# EasyEDA schematic SCH_Syntheseproject_2022-10-25.json

## Sheets
1 Elektrische schema: TITLE: Elektrisch schema; REV: 1.0; Date: 2022-10-17; Sheet: 1/1; Drawn By: remusfratus; Company: HoGent
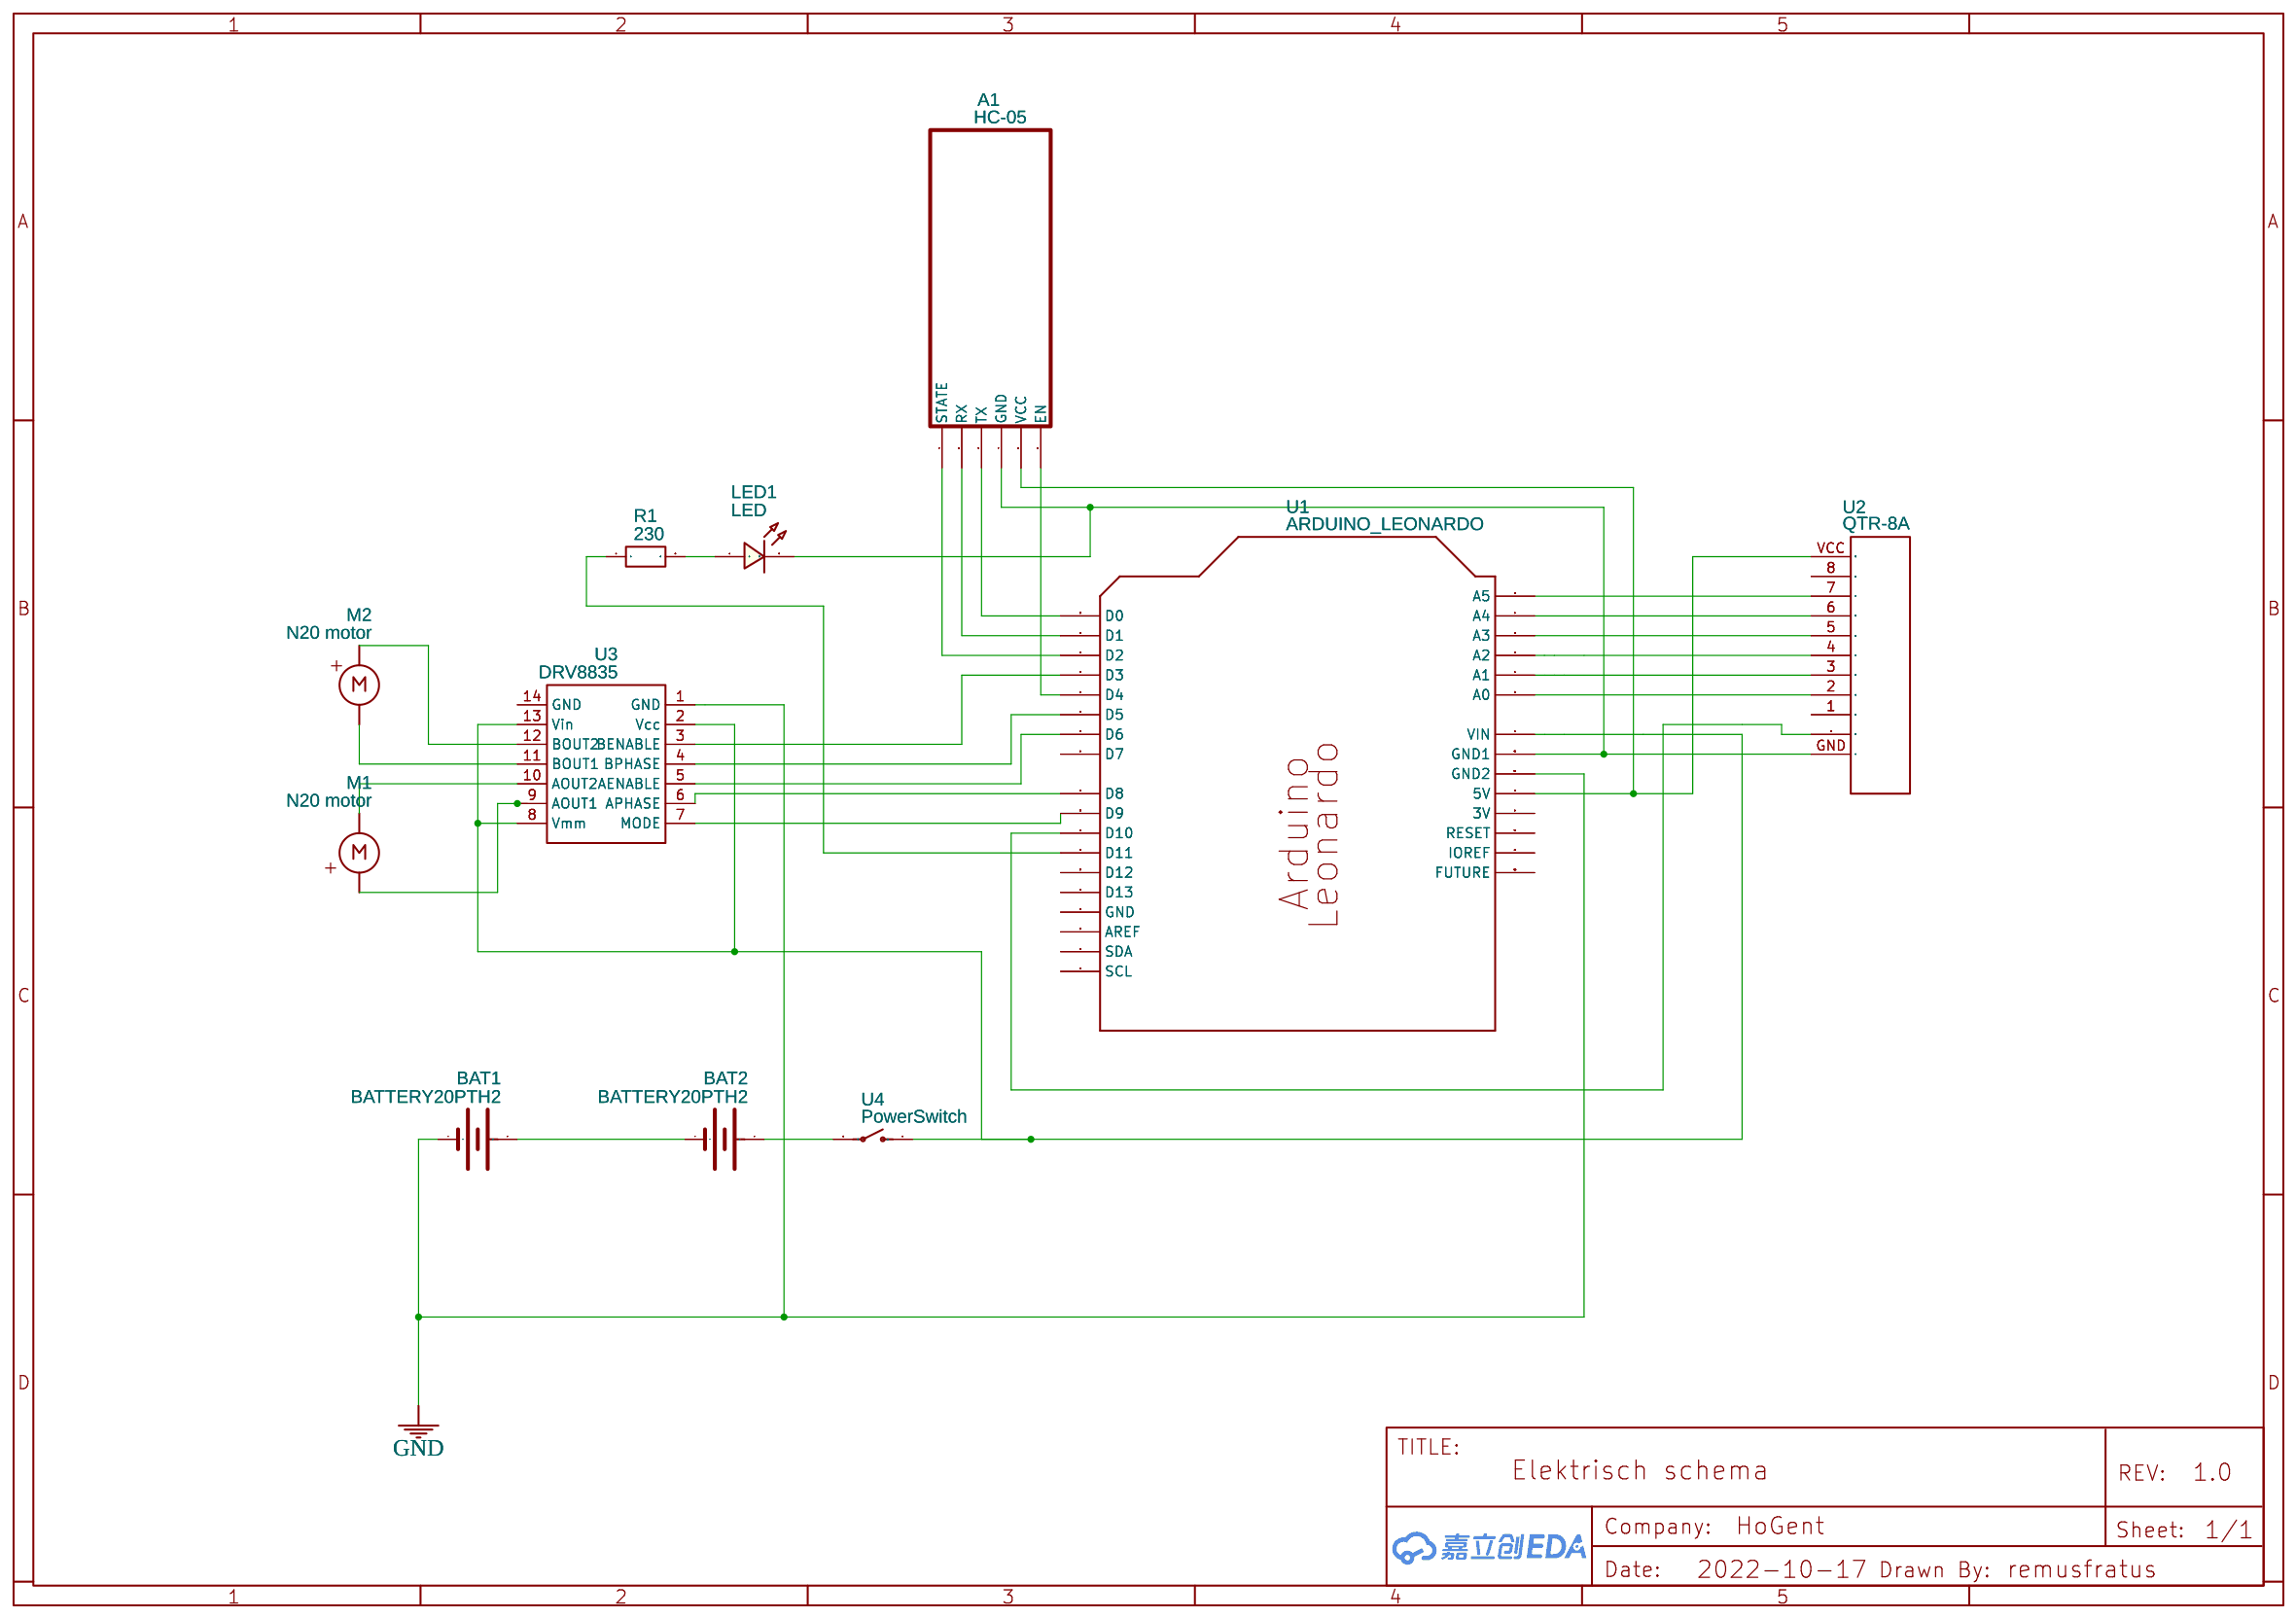
[diagram p0: Elektrische schema]
2 POC H-brug: TITLE: Sheet_3; Date: 2022-10-25; Company: Your Company
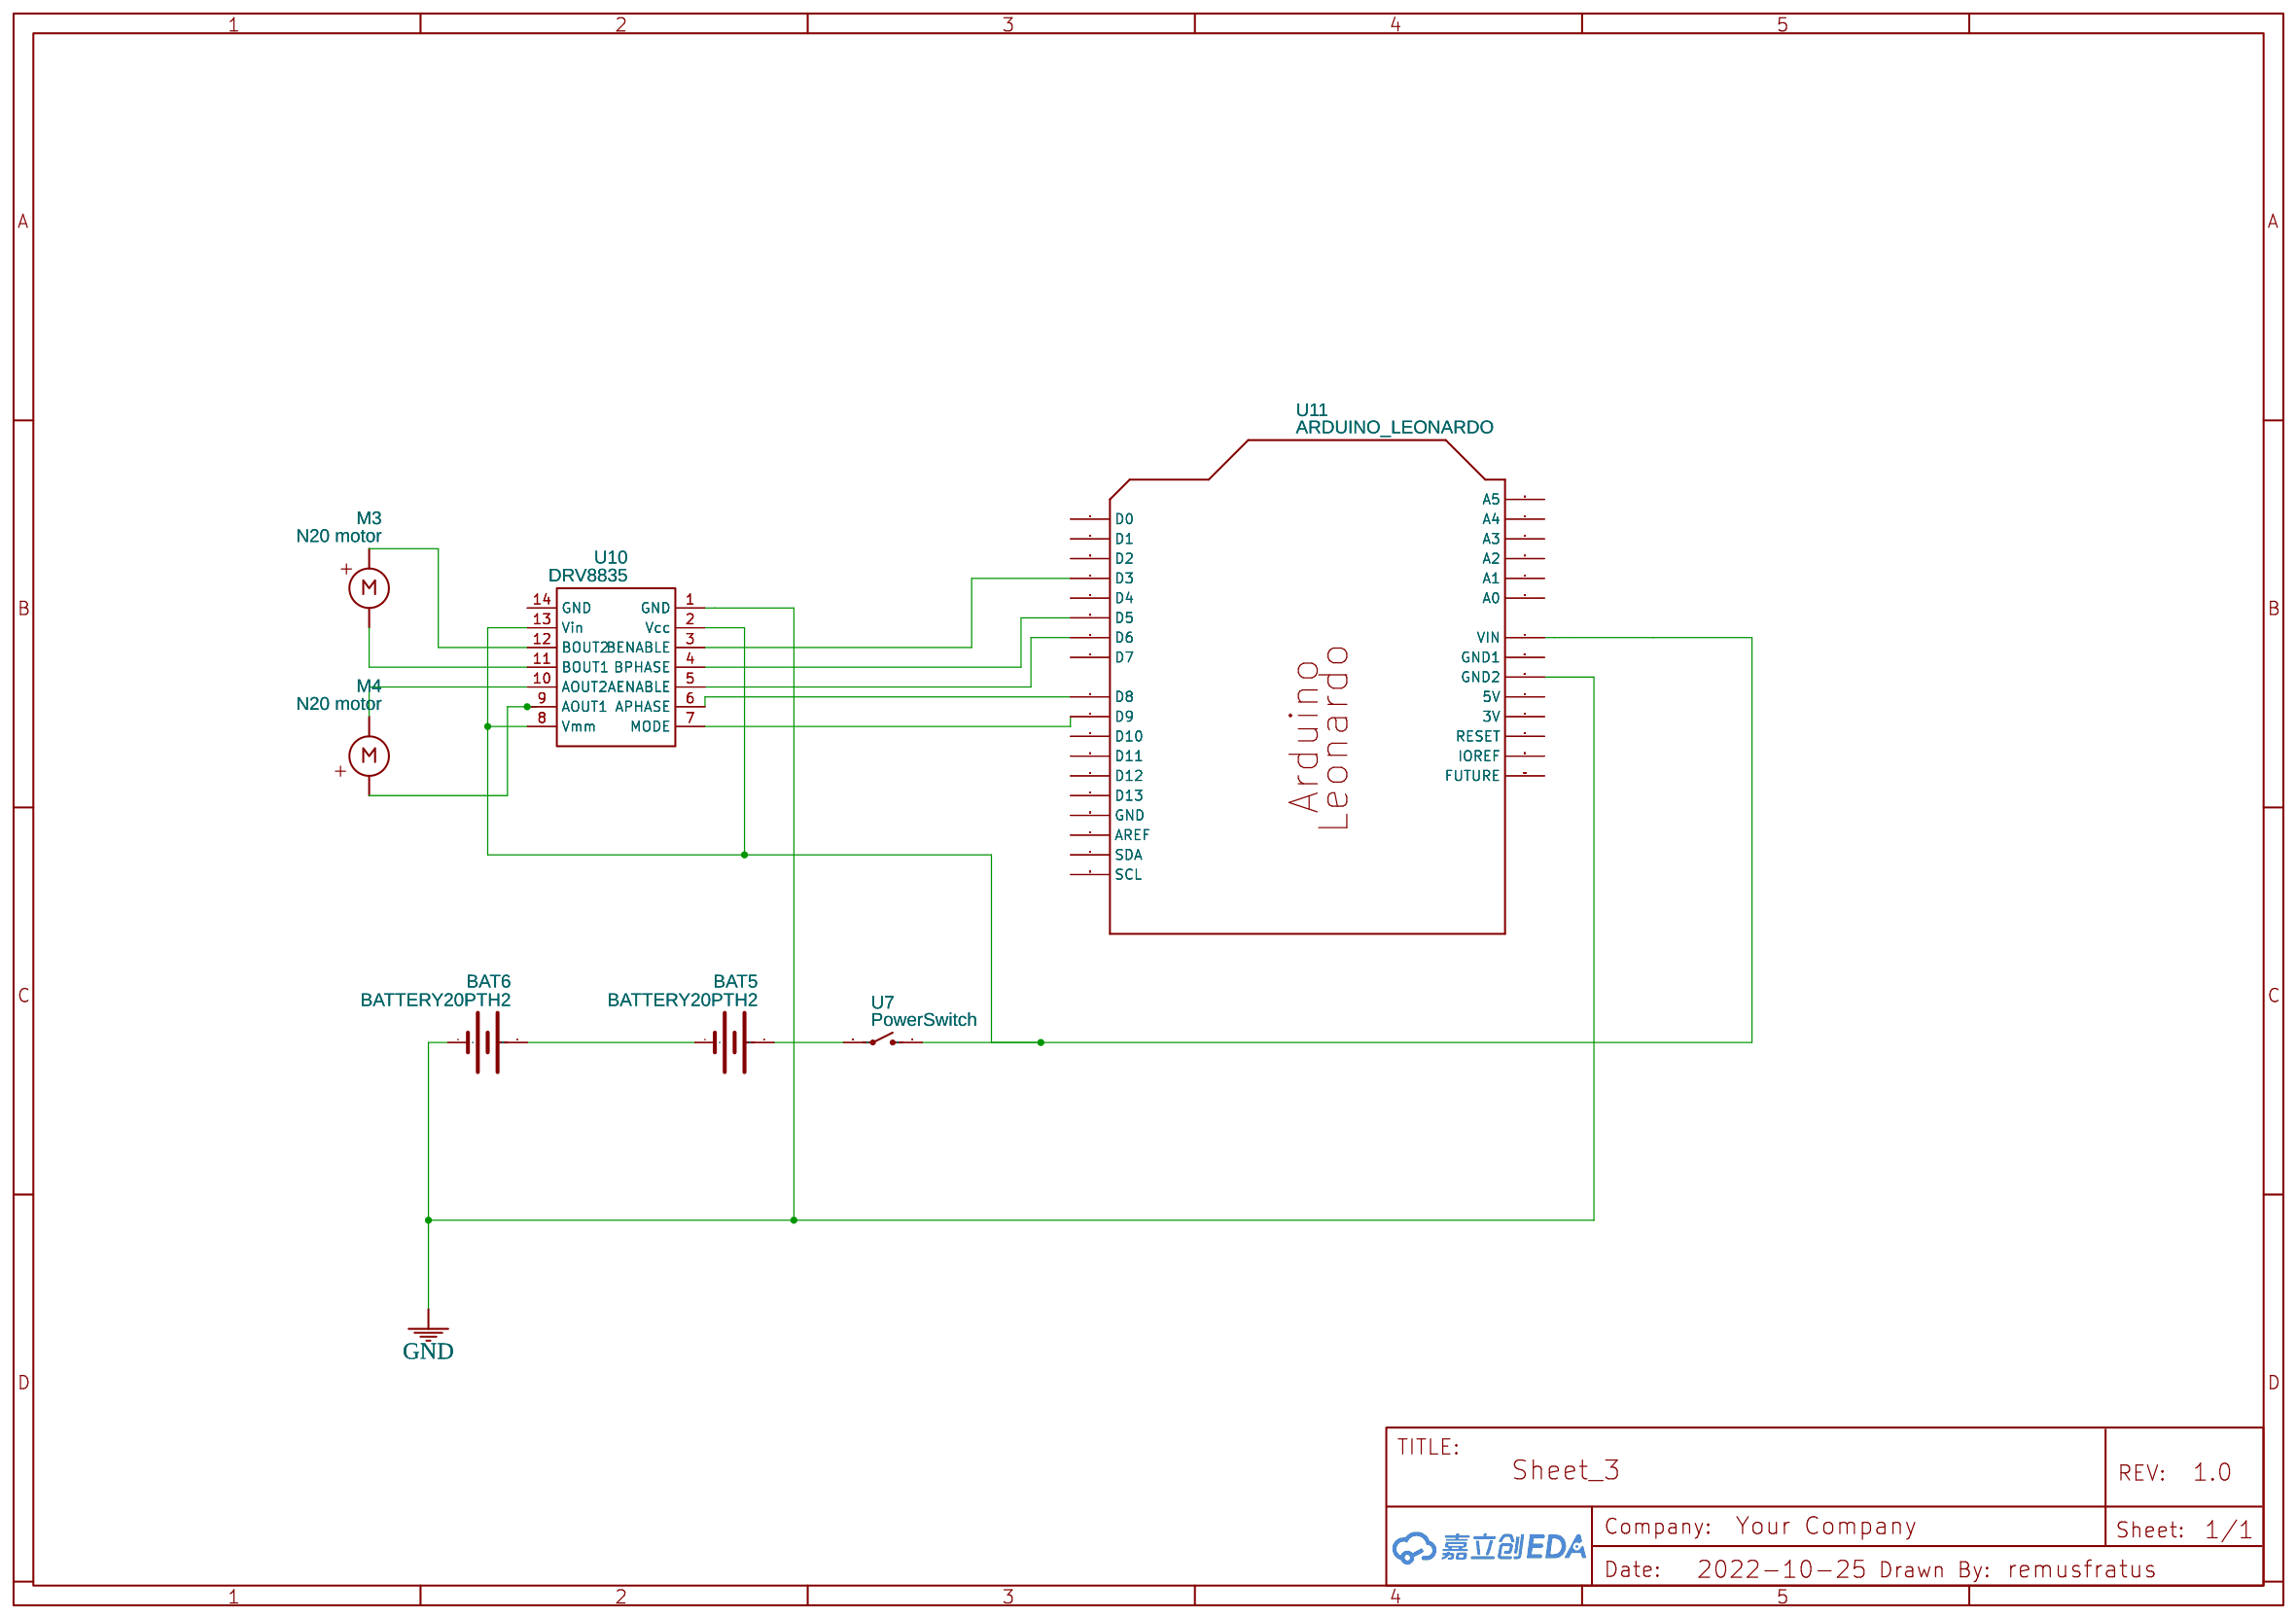
[diagram p1: POC H-brug]
3 POC sensor: TITLE: Sheet_2; Date: 2022-10-25; Company: Your Company
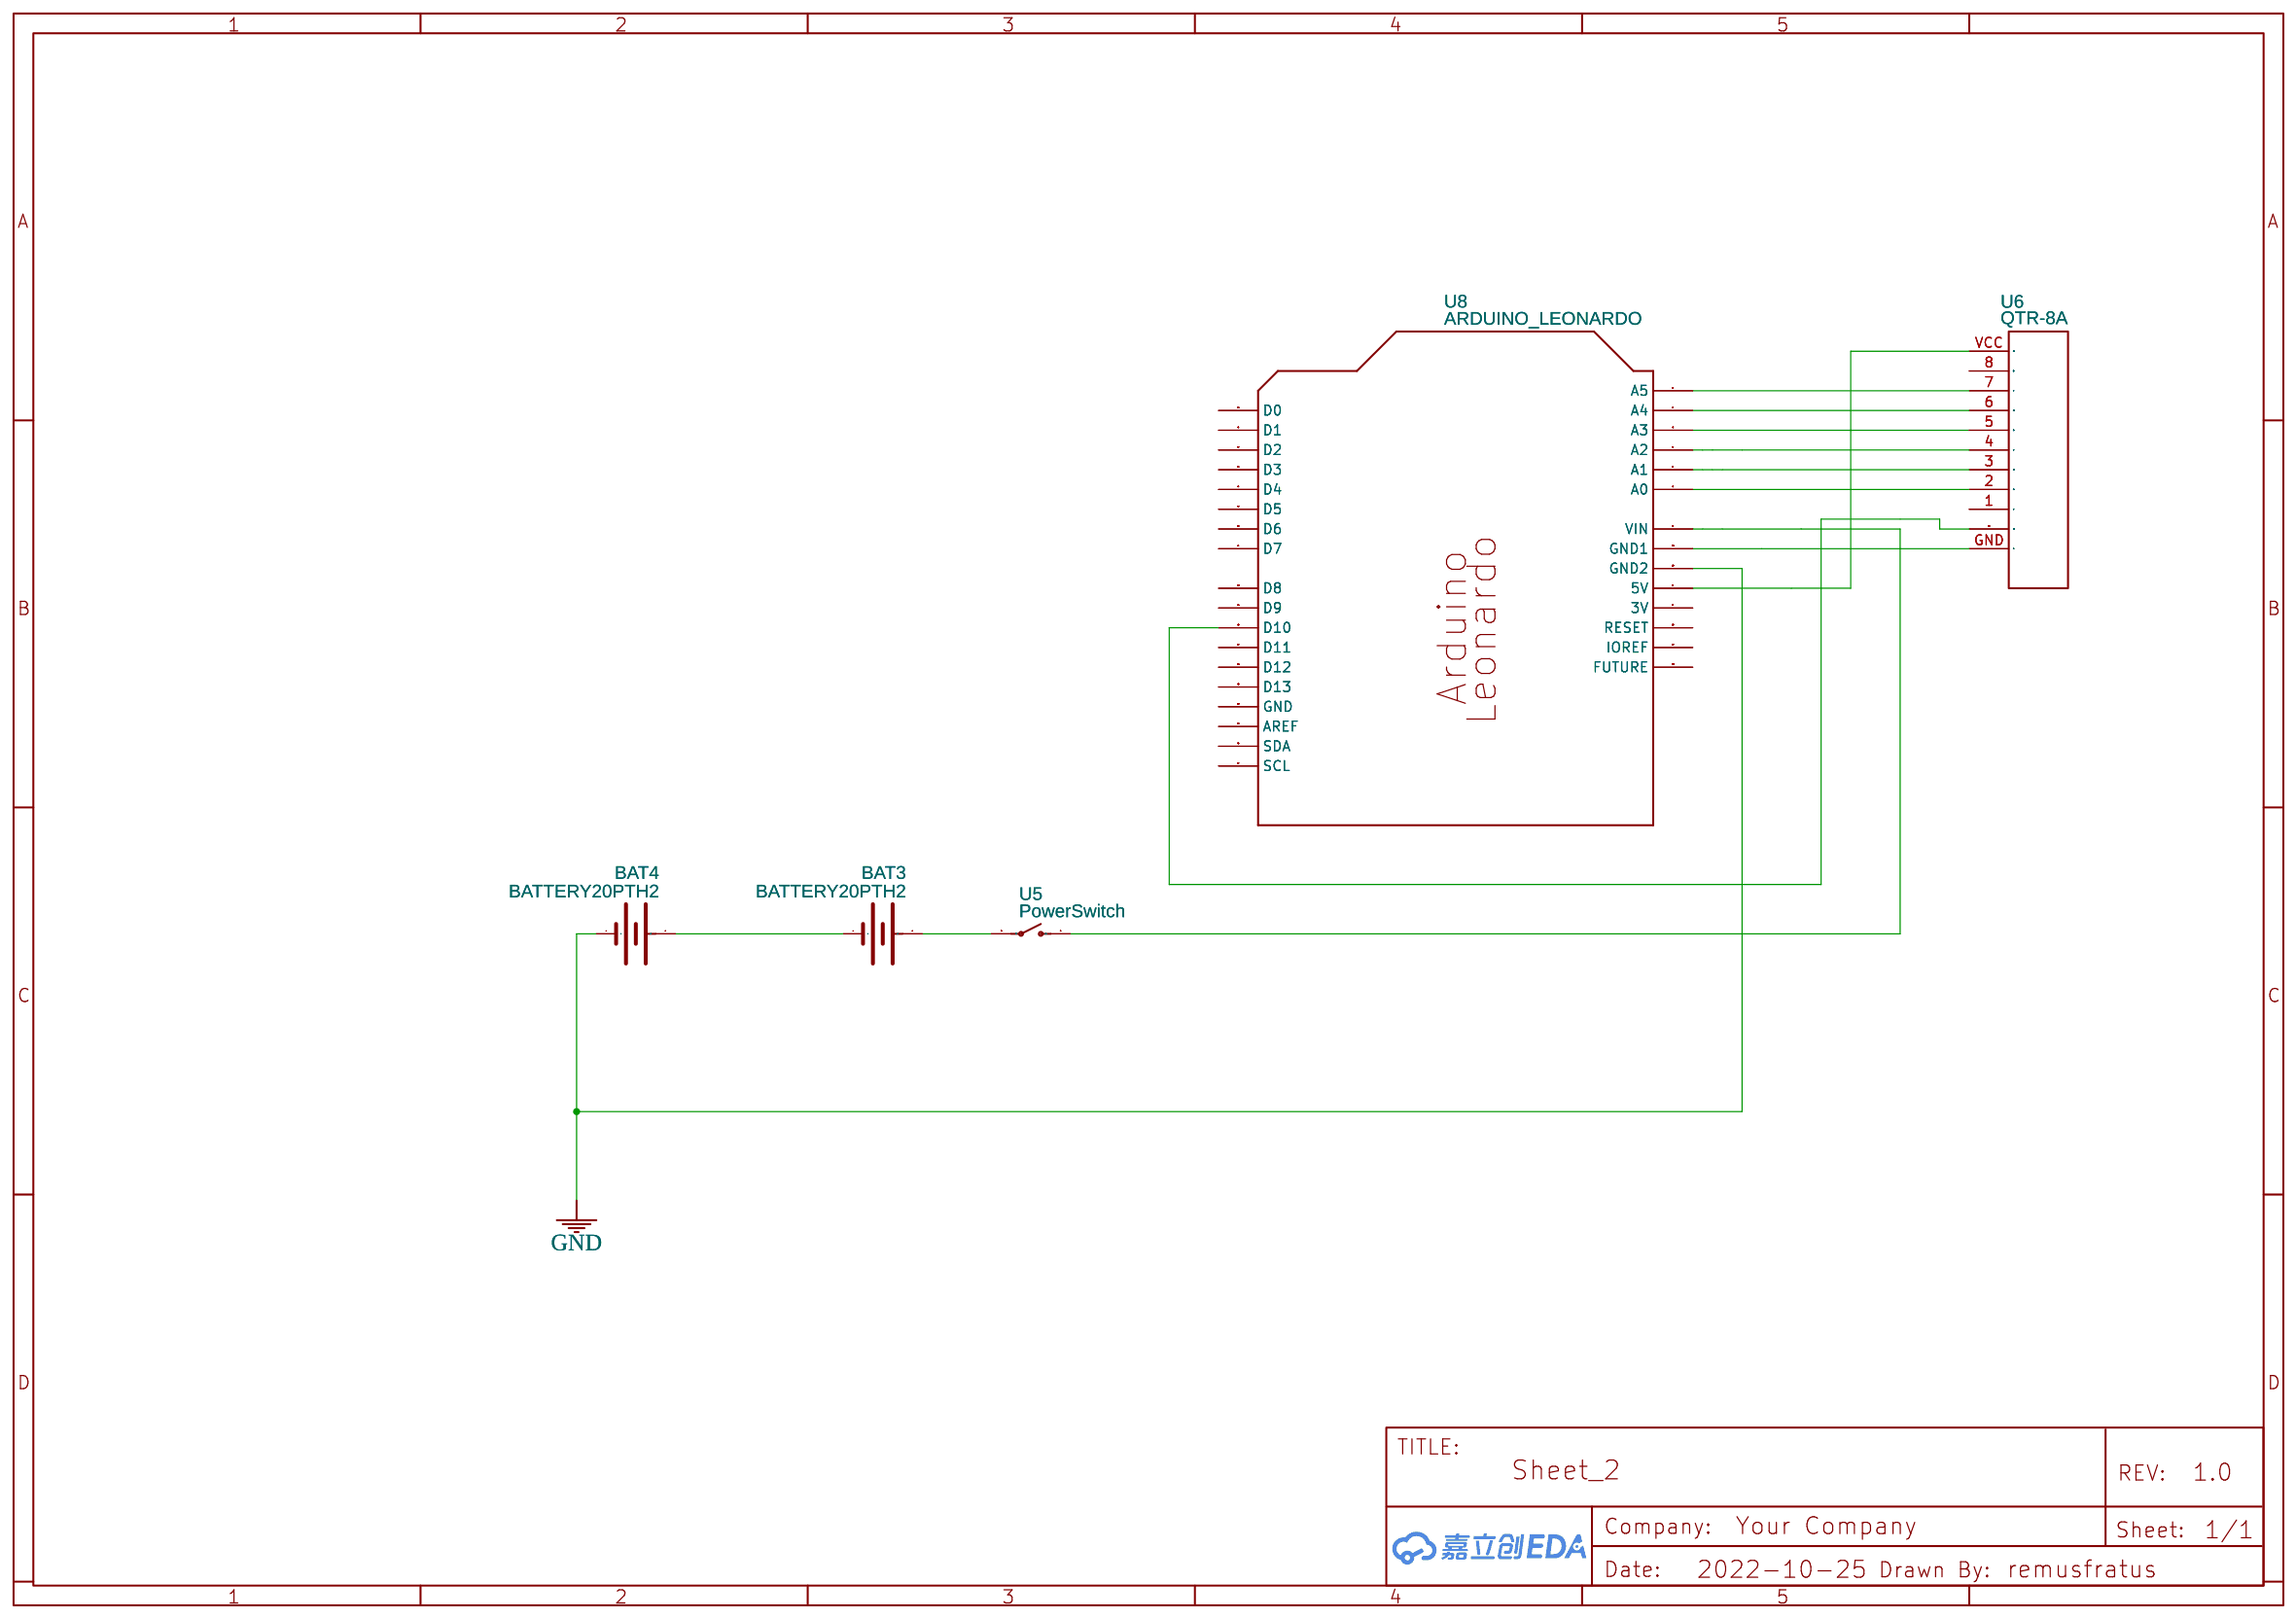
[diagram p2: POC sensor]
4 POC HC05: TITLE: Sheet_1; Date: 2022-10-25; Company: Your Company
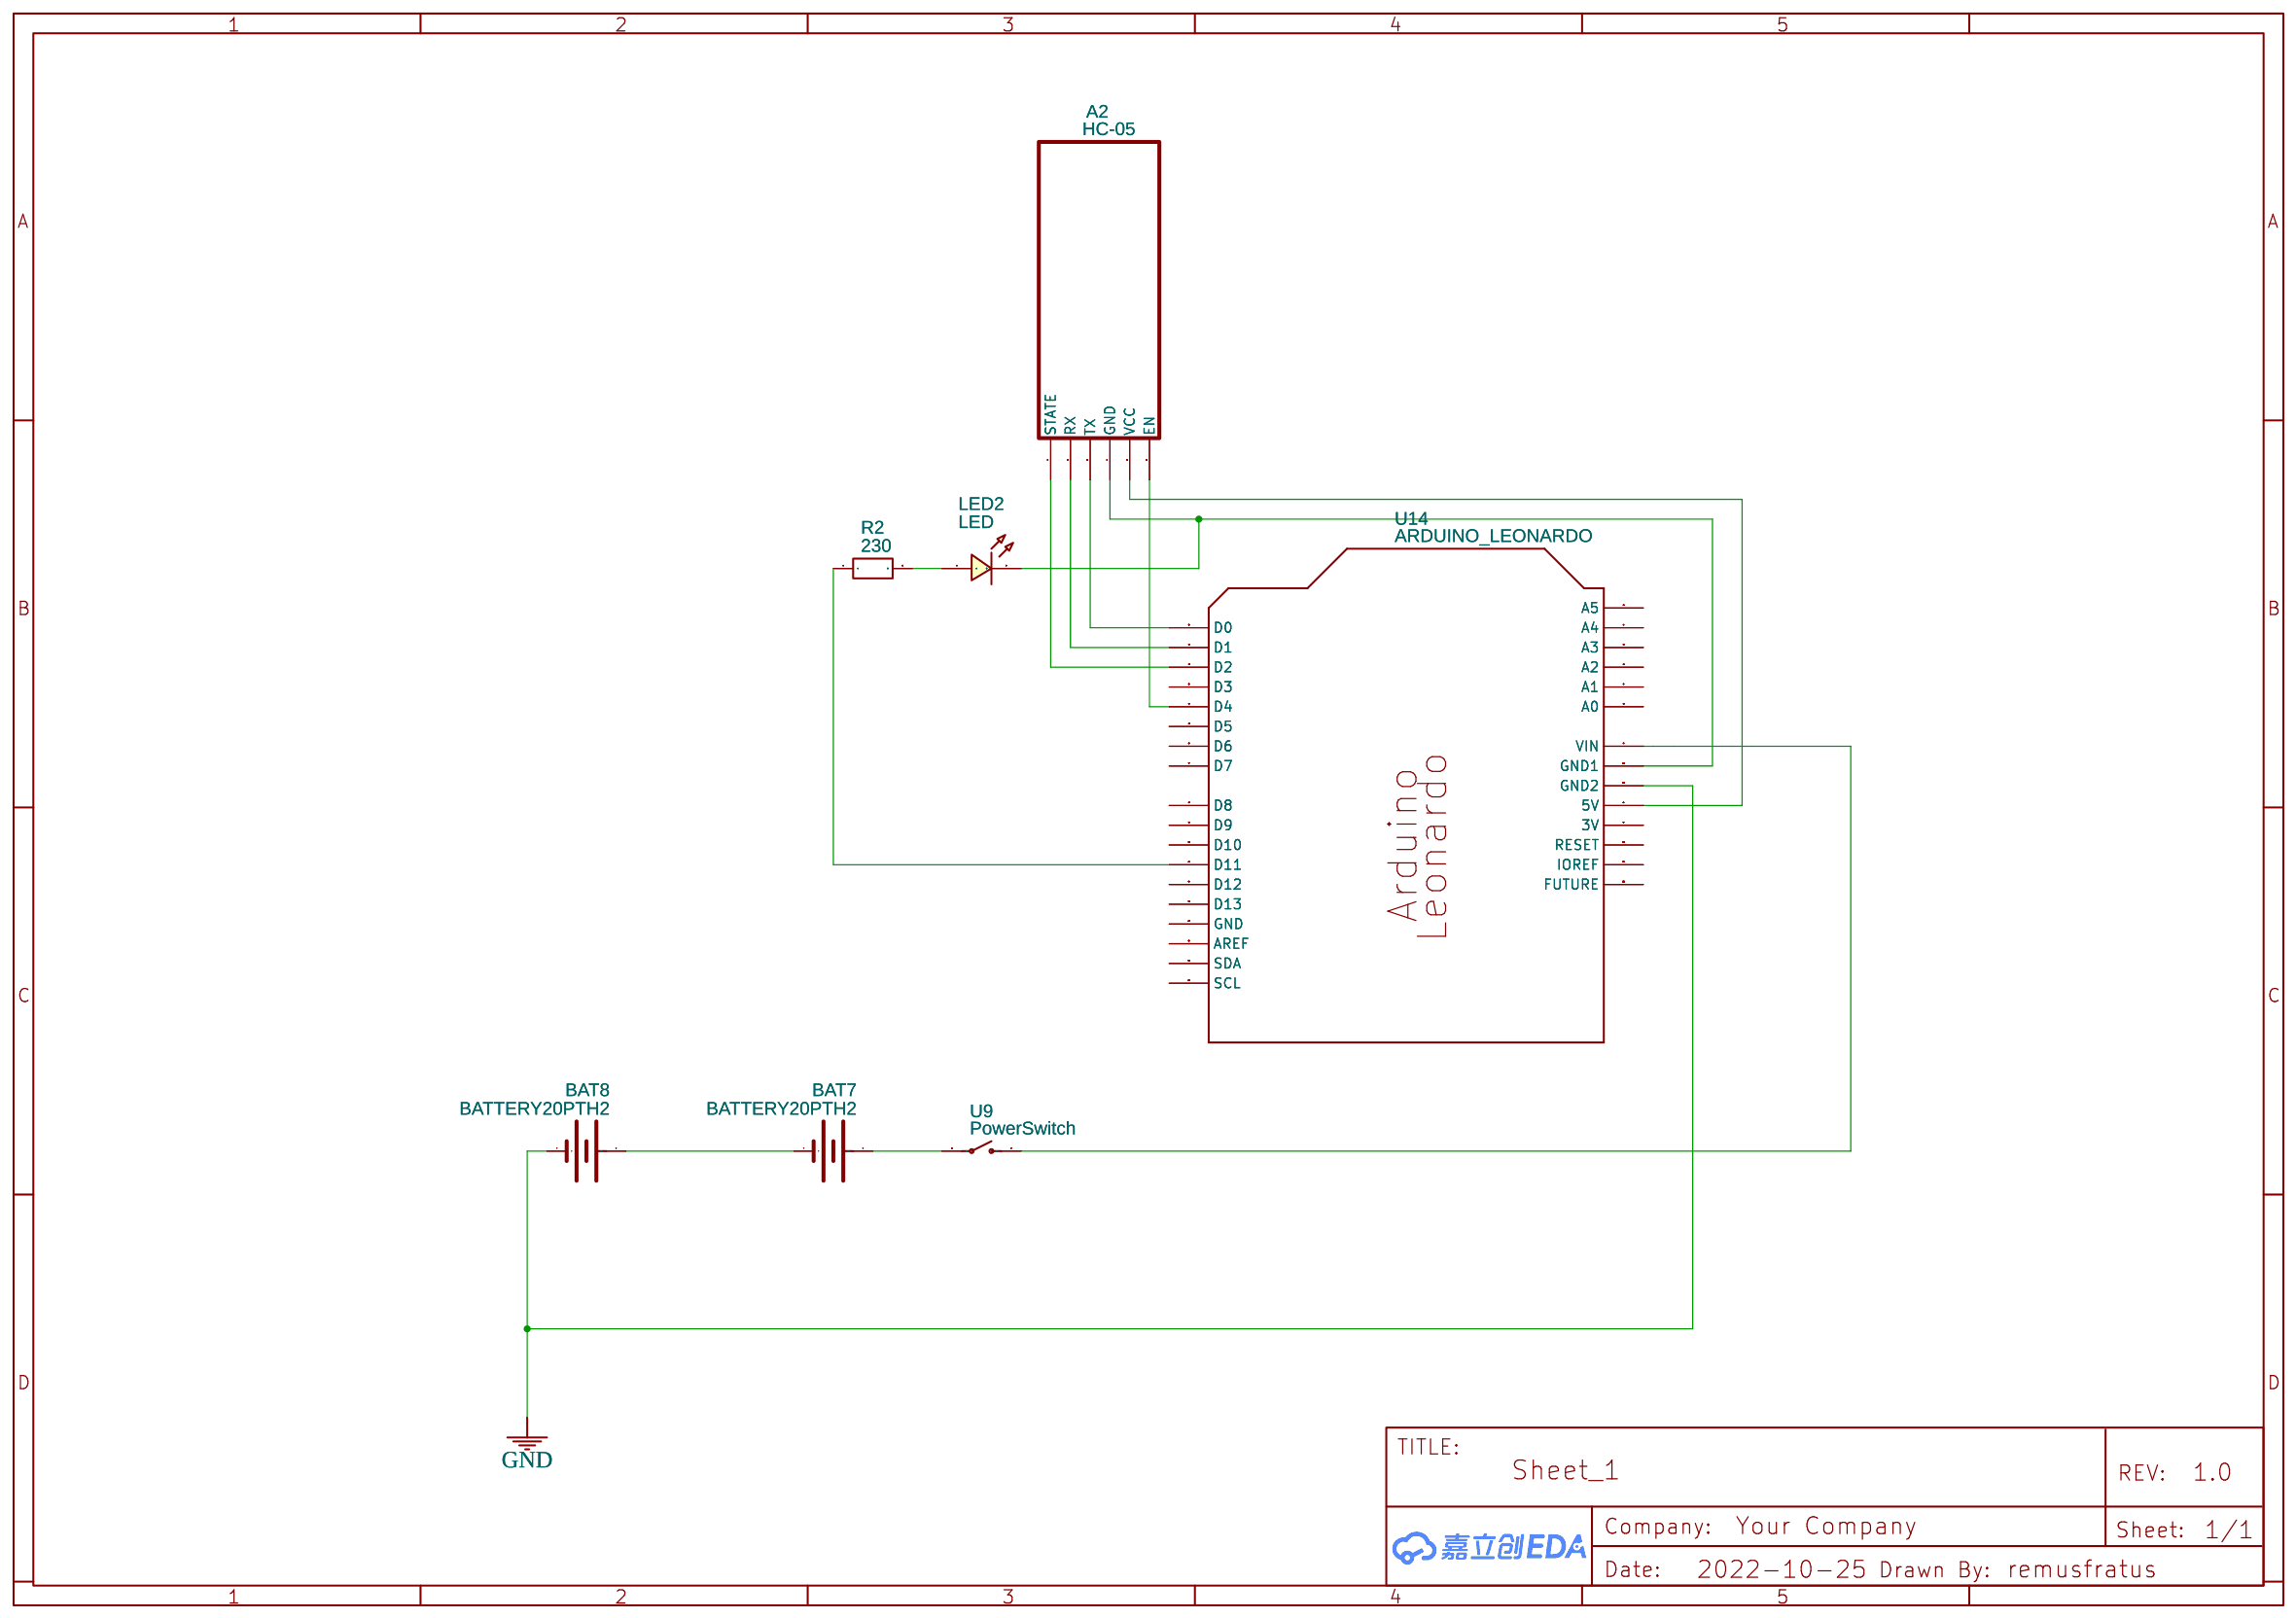
[diagram p3: POC HC05]

## Parts
sheet Elektrische schema
A1  HC-05  [HC-05]
BAT1  BATTERY20PTH2  [BATTERY]
BAT2  BATTERY20PTH2  [BATTERY]
LED1  LED  [LED0603_RED]
M1  N20 motor  [POLOLU-3071]
M2  N20 motor  [POLOLU-3071]
R1  230  [R0603]
U1  ARDUINO_LEONARDO  [ARDUINO_LEONARDO]
U2  QTR-8A  [QTR-8A]
U3  DRV8835  [DRV8835]
U4  PowerSwitch  [SWITCH-SPST-VERTICAL]
sheet POC H-brug
BAT5  BATTERY20PTH2  [BATTERY]
BAT6  BATTERY20PTH2  [BATTERY]
M3  N20 motor  [POLOLU-3071]
M4  N20 motor  [POLOLU-3071]
U7  PowerSwitch  [SWITCH-SPST-VERTICAL]
U10  DRV8835  [DRV8835]
U11  ARDUINO_LEONARDO  [ARDUINO_LEONARDO]
sheet POC HC05
A2  HC-05  [HC-05]
BAT7  BATTERY20PTH2  [BATTERY]
BAT8  BATTERY20PTH2  [BATTERY]
LED2  LED  [LED0603_RED]
R2  230  [R0603]
U9  PowerSwitch  [SWITCH-SPST-VERTICAL]
U14  ARDUINO_LEONARDO  [ARDUINO_LEONARDO]
sheet POC sensor
BAT3  BATTERY20PTH2  [BATTERY]
BAT4  BATTERY20PTH2  [BATTERY]
U5  PowerSwitch  [SWITCH-SPST-VERTICAL]
U6  QTR-8A  [QTR-8A]
U8  ARDUINO_LEONARDO  [ARDUINO_LEONARDO]

## Library data of the parts
A1 A2 = HC-05: Contributor: Dutzu
BAT1-BAT8 = BATTERY20PTH2: Battery Holders; Contributor: SparkFun
LED1 LED2 = LED-0603_R: Manufacturer: EVERLIGHT(台湾亿光); Manufacturer Part: 19-217/R6C-AL1M2VY/3T; Supplier Part: C72044; Supplier: LCSC; Contributor: LCEDA_01
M1-M4 = N20 motor: Manufacturer: Pololu; Manufacturer Part: 10:1 Micro Metal Gearmotor HPCB 6V with Extended Motor Shaft; Supplier Part: 3071; link: https://www.pololu.com/product/3071; Contributor: anjyuy
R1 R2 = R_0603_EU: Contributor: LCEDA_Lib
U1 U8 U11 U14 = ARDUINO_LEONARDO
U2 U6 = QTR-8A: Contributor: Luis D. Anaya Mtz
U3 U10 = DRV8835: Contributor: Mustafa Mutlu; Package Display: No
U4 U5 U7 U9 = SWITCH-SPST-2: Contributor: SparkFun

## Nets
GND: BAT1.- BAT4.- BAT6.- BAT8.- U1.GND$2(GND2) U3.1(GND) U8.GND$2(GND2) U10.1(GND) U11.GND$2(GND2) U14.GND$2(GND2)
Net-(A1-1): A1.1(STATE) U1.D2
Net-(A1-2): A1.2(RX) U1.D1
Net-(A1-3): A1.3(TX) U1.D0
Net-(A1-4): A1.4(GND) LED1.2 U1.D10 U1.GND$3(GND1) U2.GND(IR)
Net-(A1-5): A1.5(VCC) U1.5V U2.VCC(9)
Net-(A1-6): A1.6(EN) U1.D4
Net-(A2-1): A2.1(STATE) U14.D2
Net-(A2-2): A2.2(RX) U14.D1
Net-(A2-3): A2.3(TX) U14.D0
Net-(A2-4): A2.4(GND) LED2.2 U14.GND$3(GND1)
Net-(A2-5): A2.5(VCC) U14.5V
Net-(A2-6): A2.6(EN) U14.D4
Net-(BAT1-+): BAT1.+ BAT2.-
Net-(BAT2-+): BAT2.+ U4.2(P)
Net-(BAT3-+): BAT3.+ U5.2(P)
Net-(BAT3--): BAT3.- BAT4.+
Net-(BAT5-+): BAT5.+ U7.2(P)
Net-(BAT5--): BAT5.- BAT6.+
Net-(BAT7-+): BAT7.+ U9.2(P)
Net-(BAT7--): BAT7.- BAT8.+
Net-(LED1-1): LED1.1 R1.2
Net-(LED2-1): LED2.1 R2.2
Net-(R1-1): R1.1 U1.D11
Net-(R2-1): R2.1 U14.D11
Net-(U1-A0): U1.A0 U2.2
Net-(U1-A1): U1.A1 U2.3
Net-(U1-A2): U1.A2 U2.4
Net-(U1-A3): U1.A3 U2.5
Net-(U1-A4): U1.A4 U2.6
Net-(U1-A5): U1.A5 U2.7
Net-(U1-D3): U1.D3 U3.3(BENABLE)
Net-(U1-D5): U1.D5 U3.4(BPHASE)
Net-(U1-D6): U1.D6 U3.5(AENABLE)
Net-(U1-D8): U1.D8 U3.6(APHASE)
Net-(U1-D9): U1.D9 U3.7(MODE)
Net-(U1-VIN): U1.VIN U3.2(Vcc) U3.8(Vmm) U3.13(Vin) U4.1(O)
Net-(U5-1): U5.1(O) U8.VIN
Net-(U6-2): U6.2 U8.A0
Net-(U6-3): U6.3 U8.A1
Net-(U6-4): U6.4 U8.A2
Net-(U6-5): U6.5 U8.A3
Net-(U6-6): U6.6 U8.A4
Net-(U6-7): U6.7 U8.A5
Net-(U6-GND): U6.GND(IR) U8.D10 U8.GND$3(GND1)
Net-(U6-VCC): U6.VCC(9) U8.5V
Net-(U7-1): U7.1(O) U10.2(Vcc) U10.8(Vmm) U10.13(Vin) U11.VIN
Net-(U9-1): U9.1(O) U14.VIN
Net-(U10-3): U10.3(BENABLE) U11.D3
Net-(U10-4): U10.4(BPHASE) U11.D5
Net-(U10-5): U10.5(AENABLE) U11.D6
Net-(U10-6): U10.6(APHASE) U11.D8
Net-(U10-7): U10.7(MODE) U11.D9

Not connected (* = marked no-connect by the designer): U1 3V AREF D7 D12 D13 GND IOREF RESERVED(FUTURE) RESET SCL SDA; U2 1 8; U3 9(AOUT1) 10(AOUT2) 11(BOUT1) 12(BOUT2) 14(GND); U6 1 8; U8 3V AREF D0 D1 D2 D3 D4 D5 D6 D7 D8 D9 D11 D12 D13 GND IOREF RESERVED(FUTURE) RESET SCL SDA; U10 9(AOUT1) 10(AOUT2) 11(BOUT1) 12(BOUT2) 14(GND); U11 3V 5V A0 A1 A2 A3 A4 A5 AREF D0 D1 D2 D4 D7 D10 D11 D12 D13 GND GND$3(GND1) IOREF RESERVED(FUTURE) RESET SCL SDA; U14 3V A0 A1 A2 A3 A4 A5 AREF D3 D5 D6 D7 D8 D9 D10 D12 D13 GND IOREF RESERVED(FUTURE) RESET SCL SDA
